# Altium schematic sheet CC430_tap.SchDoc
size A
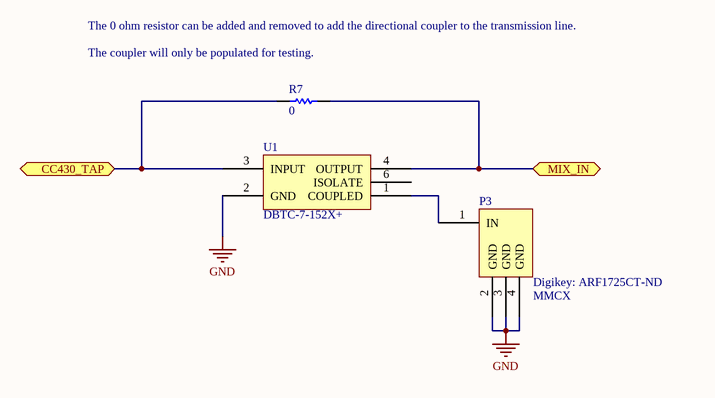
[diagram p0: CC430_tap.SchDoc]

## Parts
P3  MMCX
R7  value 0  [0402]  (hidden comment: Res Semi)
U1  DBTC-7-152X+

## Ports
CC430_TAP, MIX_IN

## Nets
GND: P3.2(GND) P3.3(GND) P3.4(GND) U1.2(GND)
CC430_TAP: R7.2 U1.3(INPUT) ; port CC430_TAP
MIX_IN: R7.1 U1.4(OUTPUT) ; port MIX_IN
NetP3_1: P3.1(IN) U1.1(COUPLED)

Not connected (* = marked no-connect by the designer): U1 6(ISOLATE)

## Notes on the sheet
- The 0 ohm resistor can be added and removed to add the directional coupler to the transmission line.
- (near R7) The coupler will only be populated for testing.
- (near P3) Digikey: ARF1725CT-ND

## Library data of the parts
R7 = Res Semi: Semiconductor Resistor; Published: 8-Jun-2000; LatestRevisionDate: 17-Jul-2002; LatestRevisionNote: Re-released for DXP Platform.; PackageReference: AXIAL-0.5; Publisher: Altium Limited; PackageDescription: Axial Device, Thru-Hole; 2 Leads; 0.5 in Pin Spacing